# EAGLE schematic focus (EAGLE 7.7.0)
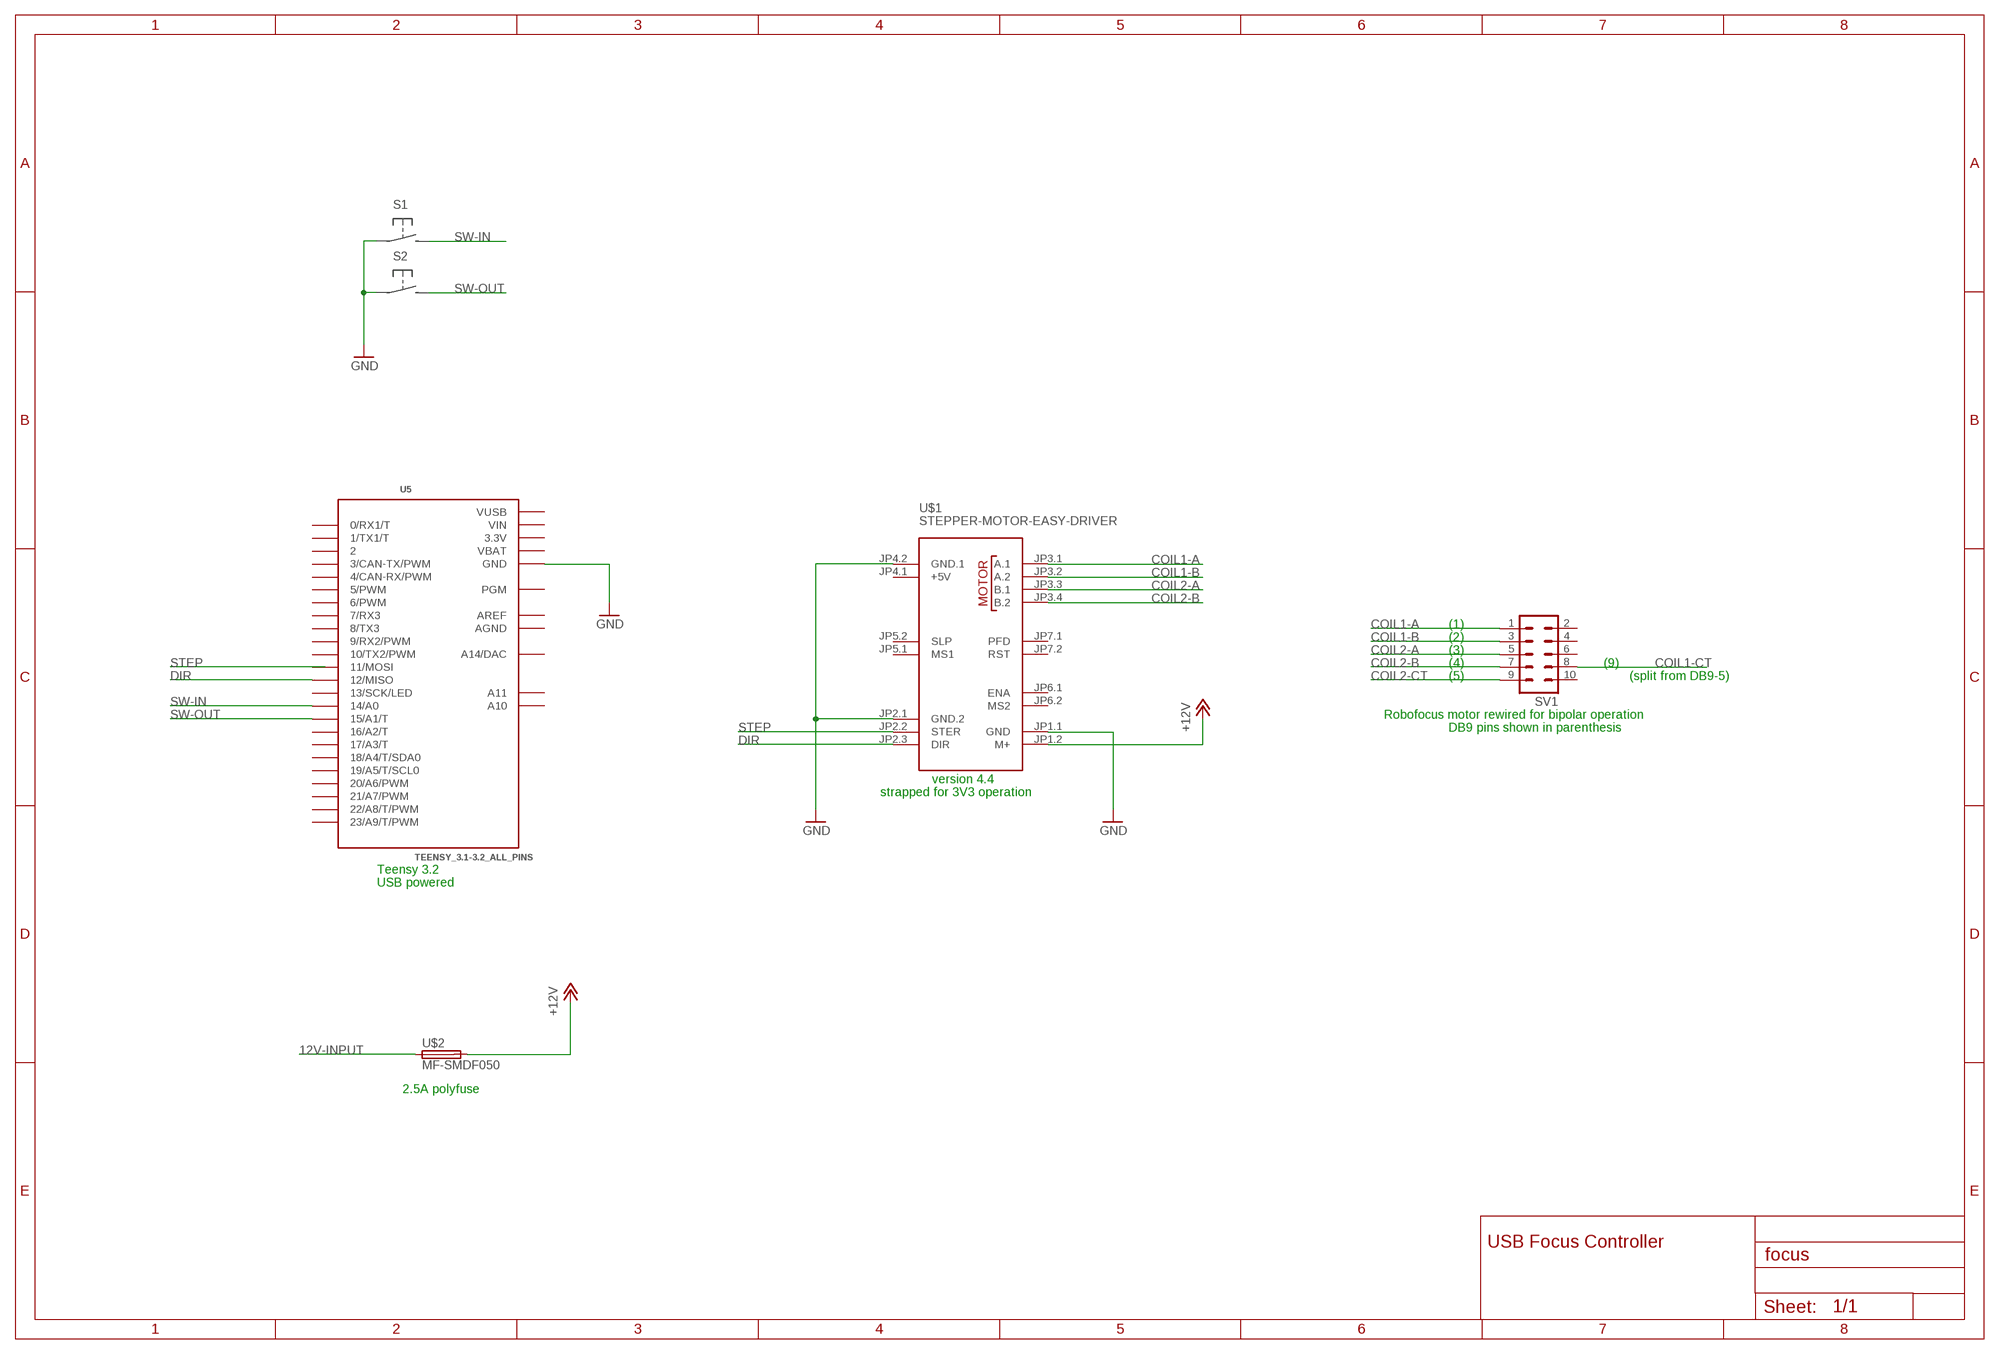
[diagram p0: schematic, sheet 1]

## Parts
SV1  MA05-2  [MA05-2]
U5  TEENSY_3.1-3.2_ALL_PINS  [TEENSY_3.0-3.2&LC_ALL_PINS]
U$1  STEPPER-MOTOR-EASY-DRIVER  [STEPPER-MOTOR-EASY-DRIVER]
U$2  MF-SMDF050  [MF-SMDF050]

## Nets
12V-INPUT: U$2.1
+12V: U$1.JP1.2(M+) U$2.2
COIL1-A: SV1.1 U$1.JP3.1(A.1)
COIL1-B: SV1.3 U$1.JP3.2(A.2)
COIL1-CT: SV1.8
COIL2-A: SV1.5 U$1.JP3.3(B.1)
COIL2-B: SV1.7 U$1.JP3.4(B.2)
COIL2-CT: SV1.9
DIR: U5.12(12/MISO) U$1.JP2.3(DIR)
GND: U5.GND U5.GND1(GND) U$1.JP1.1(GND) U$1.JP2.1(GND.2) U$1.JP4.2(GND.1)
STEP: U5.11(11/MOSI) U$1.JP2.2(STER)
SW-IN: U5.14/A0
SW-OUT: U5.15/A1(15/A1/T)
Unconnected: SV1.2 SV1.4 SV1.6 SV1.10 U5.0(0/RX1/T) U5.1(1/TX1/T) U5.2 U5.3(3/CAN-TX/PWM) U5.4(4/CAN-RX/PWM) U5.5(5/PWM) U5.6(6/PWM) U5.7(7/RX3) U5.8(8/TX3) U5.9(9/RX2/PWM) U5.10(10/TX2/PWM) U5.13(13/SCK/LED) U5.16/A2(16/A2/T) U5.17/A3(17/A3/T) U5.18/A4(18/A4/T/SDA0) U5.19/A5(19/A5/T/SCL0) U5.20/A6(20/A6/PWM) U5.21/A7(21/A7/PWM) U5.22/A8(22/A8/T/PWM) U5.23/A9(23/A9/T/PWM) U5.A10 U5.A11 U5.PGM U5.RESET/DAC(A14/DAC) U$1.JP4.1(+5V) U$1.JP5.1(MS1) U$1.JP5.2(SLP) U$1.JP6.1(ENA) U$1.JP6.2(MS2) U$1.JP7.1(PFD) U$1.JP7.2(RST)

## Notes on the sheet
- (1)
- (2)
- (3)
- (4) | (9)
- (5) | (split from DB9-5)
- Robofocus motor rewired for bipolar operation
- DB9 pins shown in parenthesis
- version 4.4
- strapped for 3V3 operation
- Teensy 3.2
- USB powered
- 2.5A polyfuse
- USB Focus Controller

## Power pins joined to a net without a drawn wire
3.3V: U5.3.3V U5.3.3V1(3.3V)
AGND: U5.AGND
AREF: U5.AREF
VBAT: U5.VBAT
VIN: U5.VIN
VUSB: U5.VUSB

## Library data of the parts
SV1 = con-lstb:MA05-2: PIN HEADER; OC_FARNELL: unknown; OC_NEWARK: unknown
U5 = Teensy_3_and_LC_Series_Boards_v1.4:TEENSY_3.1-3.2_ALL_PINS: Footprint for Teensy 3.1 or 3.2 board using all through-holes, i.e. the entire perimeter plus the 4 through-holes inboard (A10,A11,AREF, VUSB)
U$1 = diy-modules:STEPPER-MOTOR-EASY-DRIVER: Stepper Motor Easy Driver Project page: http://www.schmalzhaus.com/EasyDriver/ Click here to find device on ebay.com <http://www.ebay.com/sch/easydriver+stepper+motor+driver>
U$2 = fuse:MF-SMDF: MF-SMDF Series - PRC Resettable Fuses Source: http://www.farnell.com/datasheets/716597.pdf